# Altium schematic sheet 201944AEP4P03.SchDoc
size A4
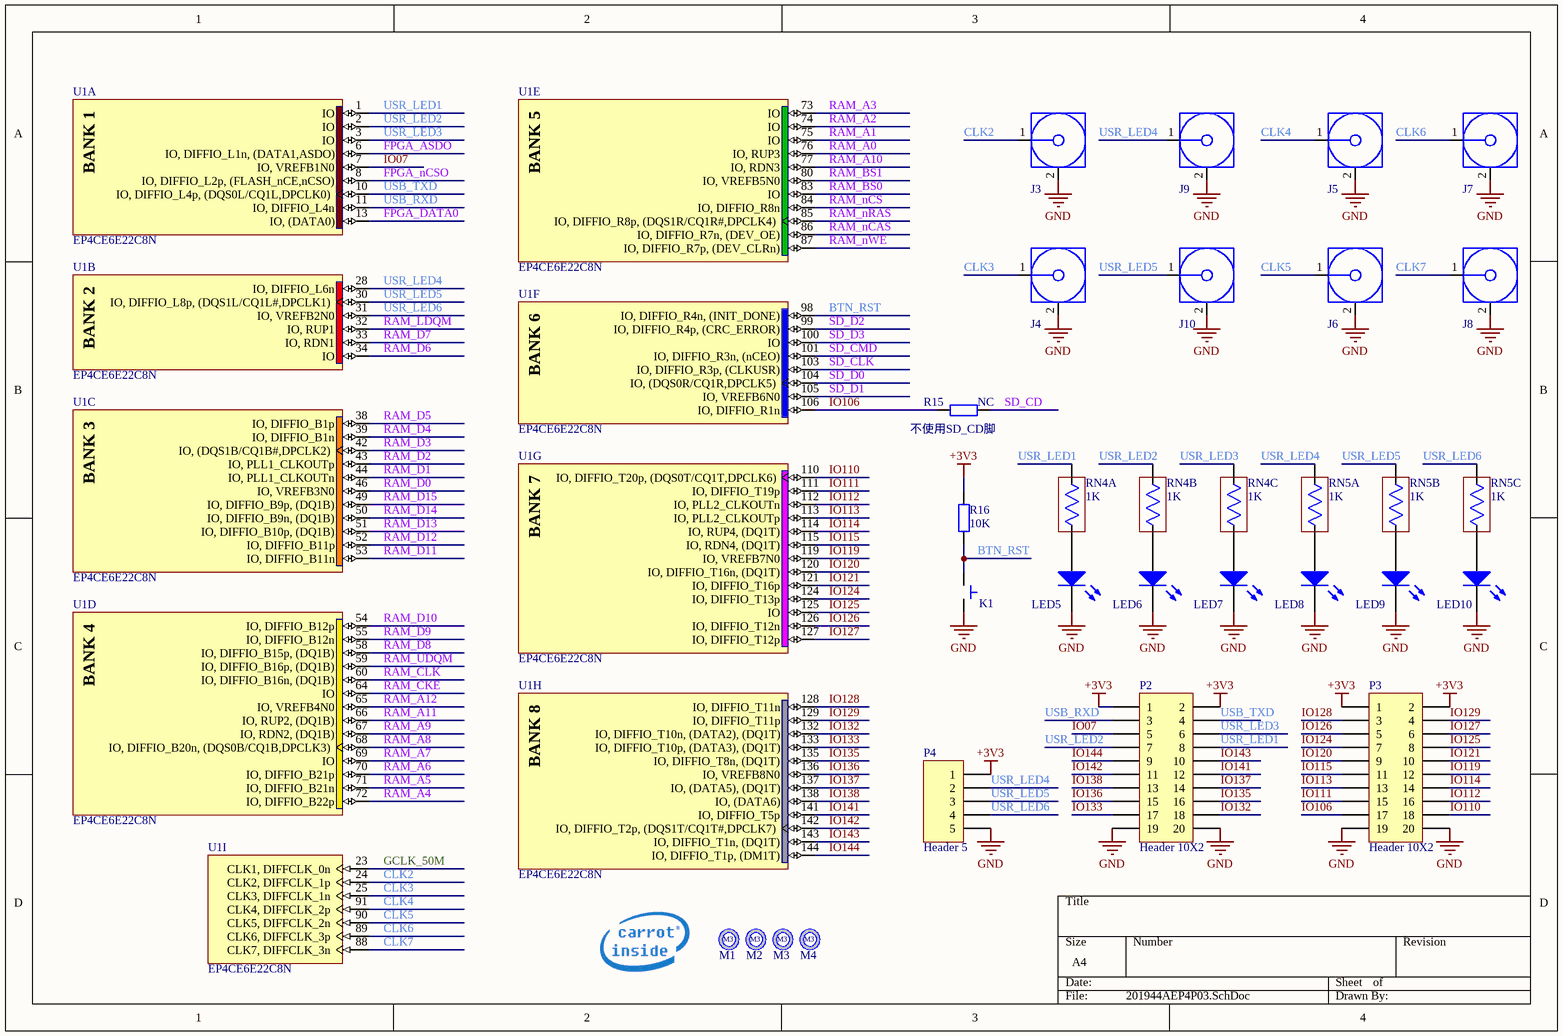
[diagram p0: 201944AEP4P03.SchDoc]

## Parts
J3  SMA  [SMA-1]  (value not drawn)
J4  SMA  [SMA-1]  (value not drawn)
J5  SMA  [SMA-1]  (value not drawn)
J6  SMA  [SMA-1]  (value not drawn)
J7  SMA  [SMA-1]  (value not drawn)
J8  SMA  [SMA-1]  (value not drawn)
J9  SMA  [SMA-1]  (value not drawn)
J10  SMA  [SMA-1]  (value not drawn)
K1  轻触开关  [Button-SMT-Small]  (value not drawn)
LED5  LED  [LED1206]  (value not drawn)
LED6  LED  [LED1206]  (value not drawn)
LED7  LED  [LED1206]  (value not drawn)
LED8  LED  [LED1206]  (value not drawn)
LED9  LED  [LED1206]  (value not drawn)
LED10  LED  [LED1206]  (value not drawn)
LOGO1  Logo Carrot Inside  [LOGO-carrot-inside]  (value not drawn)
M1  M3  [M3-3.2X5]  (value not drawn)
M2  M3  [M3-3.2X5]  (value not drawn)
M3  M3  [M3-3.2X5]  (value not drawn)
M4  M3  [M3-3.2X5]  (value not drawn)
P2  Header 10X2  [HDR2X10]
P3  Header 10X2  [HDR2X10]
P4  Header 5  [HDR1X5]
R15  value NC  [R0805]  (hidden comment: Res)
R16  value 10K  [R0805]  (hidden comment: Res)
RN4  value 1K  [RA0603]  (hidden comment: Res Array)  (parts A,B,C of 4)
RN5  value 1K  [RA0603]  (hidden comment: Res Array)  (parts A,B,C of 4)
U1  EP4CE6E22C8N  [EP4CE6E22C8N-EQFP144+]  (parts A,B,C,D,E,F,G,H,I of 13)

## Nets
+3V3: P2.1 P2.2 P3.1 P3.2 P4.1 R16.1
GND: J3.2(GND) J4.2(GND) J5.2(GND) J6.2(GND) J7.2(GND) J8.2(GND) J9.2(GND) J10.2(GND) K1.2(OUT) LED5.2(K) LED6.2(K) LED7.2(K) LED8.2(K) LED9.2(K) LED10.2(K) P2.19 P2.20 P3.19 P3.20 P4.5
BTN_RST: K1.1(IN) R16.2 U1.98(IO,_DIFFIO_R4n,_(INIT_DONE))
CLK2: J3.1(Signal) U1.24(CLK2,_DIFFCLK_1p)
CLK3: J4.1(Signal) U1.25(CLK3,_DIFFCLK_1n)
CLK4: J5.1(Signal) U1.91(CLK4,_DIFFCLK_2p)
CLK5: J6.1(Signal) U1.90(CLK5,_DIFFCLK_2n)
CLK6: J7.1(Signal) U1.89(CLK6,_DIFFCLK_3p)
CLK7: J8.1(Signal) U1.88(CLK7,_DIFFCLK_3n)
FPGA_ASDO: U1.6(IO,_DIFFIO_L1n,_(DATA1,ASDO))
FPGA_DATA0: U1.13(IO,_(DATA0))
FPGA_nCSO: U1.8(IO,_DIFFIO_L2p,_(FLASH_nCE,nCSO))
GCLK_50M: U1.23(CLK1,_DIFFCLK_0n)
IO07: P2.5 U1.7(IO,_VREFB1N0)
IO106: P3.17 R15.1 U1.106(IO,_DIFFIO_R1n)
IO110: P3.18 U1.110(IO,_DIFFIO_T20p,_(DQS0T/CQ1T,DPCLK6))
IO111: P3.15 U1.111(IO,_DIFFIO_T19p)
IO112: P3.16 U1.112(IO,_PLL2_CLKOUTn)
IO113: P3.13 U1.113(IO,_PLL2_CLKOUTp)
IO114: P3.14 U1.114(IO,_RUP4,_(DQ1T))
IO115: P3.11 U1.115(IO,_RDN4,_(DQ1T))
IO119: P3.12 U1.119(IO,_VREFB7N0)
IO120: P3.9 U1.120(IO,_DIFFIO_T16n,_(DQ1T))
IO121: P3.10 U1.121(IO,_DIFFIO_T16p)
IO124: P3.7 U1.124(IO,_DIFFIO_T13p)
IO125: P3.8 U1.125(IO)
IO126: P3.5 U1.126(IO,_DIFFIO_T12n)
IO127: P3.6 U1.127(IO,_DIFFIO_T12p)
IO128: P3.3 U1.128(IO,_DIFFIO_T11n)
IO129: P3.4 U1.129(IO,_DIFFIO_T11p)
IO132: P2.18 U1.132(IO,_DIFFIO_T10n,_(DATA2),_(DQ1T))
IO133: P2.17 U1.133(IO,_DIFFIO_T10p,_(DATA3),_(DQ1T))
IO135: P2.16 U1.135(IO,_DIFFIO_T8n,_(DQ1T))
IO136: P2.15 U1.136(IO,_VREFB8N0)
IO137: P2.14 U1.137(IO,_(DATA5),_(DQ1T))
IO138: P2.13 U1.138(IO,_(DATA6))
IO141: P2.12 U1.141(IO,_DIFFIO_T5p)
IO142: P2.11 U1.142(IO,_DIFFIO_T2p,_(DQS1T/CQ1T#,DPCLK7))
IO143: P2.10 U1.143(IO,_DIFFIO_T1n,_(DQ1T))
IO144: P2.9 U1.144(IO,_DIFFIO_T1p,_(DM1T))
RAM_A0: U1.76(IO,_RUP3)
RAM_A1: U1.75(IO)
RAM_A2: U1.74(IO)
RAM_A3: U1.73(IO)
RAM_A4: U1.72(IO,_DIFFIO_B22p)
RAM_A5: U1.71(IO,_DIFFIO_B21n)
RAM_A6: U1.70(IO,_DIFFIO_B21p)
RAM_A7: U1.69(IO)
RAM_A8: U1.68(IO,_DIFFIO_B20n,_(DQS0B/CQ1B,DPCLK3))
RAM_A9: U1.67(IO,_RDN2,_(DQ1B))
RAM_A10: U1.77(IO,_RDN3)
RAM_A11: U1.66(IO,_RUP2,_(DQ1B))
RAM_A12: U1.65(IO,_VREFB4N0)
RAM_BS0: U1.83(IO)
RAM_BS1: U1.80(IO,_VREFB5N0)
RAM_CKE: U1.64(IO)
RAM_CLK: U1.60(IO,_DIFFIO_B16n,_(DQ1B))
RAM_D0: U1.46(IO,_VREFB3N0)
RAM_D1: U1.44(IO,_PLL1_CLKOUTn)
RAM_D2: U1.43(IO,_PLL1_CLKOUTp)
RAM_D3: U1.42(IO,_(DQS1B/CQ1B#,DPCLK2))
RAM_D4: U1.39(IO,_DIFFIO_B1n)
RAM_D5: U1.38(IO,_DIFFIO_B1p)
RAM_D6: U1.34(IO)
RAM_D7: U1.33(IO,_RDN1)
RAM_D8: U1.58(IO,_DIFFIO_B15p,_(DQ1B))
RAM_D9: U1.55(IO,_DIFFIO_B12n)
RAM_D10: U1.54(IO,_DIFFIO_B12p)
RAM_D11: U1.53(IO,_DIFFIO_B11n)
RAM_D12: U1.52(IO,_DIFFIO_B11p)
RAM_D13: U1.51(IO,_DIFFIO_B10p,_(DQ1B))
RAM_D14: U1.50(IO,_DIFFIO_B9n,_(DQ1B))
RAM_D15: U1.49(IO,_DIFFIO_B9p,_(DQ1B))
RAM_LDQM: U1.32(IO,_RUP1)
RAM_nCAS: U1.86(IO,_DIFFIO_R7n,_(DEV_OE))
RAM_nCS: U1.84(IO,_DIFFIO_R8n)
RAM_nRAS: U1.85(IO,_DIFFIO_R8p,_(DQS1R/CQ1R#,DPCLK4))
RAM_nWE: U1.87(IO,_DIFFIO_R7p,_(DEV_CLRn))
RAM_UDQM: U1.59(IO,_DIFFIO_B16p,_(DQ1B))
SD_CD: R15.2
SD_CLK: U1.103(IO,_DIFFIO_R3p,_(CLKUSR))
SD_CMD: U1.101(IO,_DIFFIO_R3n,_(nCEO))
SD_D0: U1.104(IO,_(DQS0R/CQ1R,DPCLK5))
SD_D1: U1.105(IO,_VREFB6N0)
SD_D2: U1.99(IO,_DIFFIO_R4p,_(CRC_ERROR))
SD_D3: U1.100(IO)
USB_RXD: P2.3 U1.11(IO,_DIFFIO_L4n)
USB_TXD: P2.4 U1.10(IO,_DIFFIO_L4p,_(DQS0L/CQ1L,DPCLK0))
USR_LED1: P2.8 RN4.8 U1.1(IO)
USR_LED2: P2.7 RN4.7 U1.2(IO)
USR_LED3: P2.6 RN4.6 U1.3(IO)
USR_LED4: J9.1(Signal) P4.2 RN5.8 U1.28(IO,_DIFFIO_L6n)
USR_LED5: J10.1(Signal) P4.3 RN5.7 U1.30(IO,_DIFFIO_L8p,_(DQS1L/CQ1L#,DPCLK1))
USR_LED6: P4.4 RN5.6 U1.31(IO,_VREFB2N0)
NetLED5_1: LED5.1(A) RN4.1
NetLED6_1: LED6.1(A) RN4.2
NetLED7_1: LED7.1(A) RN4.3
NetLED8_1: LED8.1(A) RN5.1
NetLED9_1: LED9.1(A) RN5.2
NetLED10_1: LED10.1(A) RN5.3

## Notes on the sheet
- (near R15) 不使用SD_CD脚
- (in symbol EP4CE6E22C8N, part A) BANK 1
- (in symbol EP4CE6E22C8N, part B) BANK 2
- (in symbol EP4CE6E22C8N, part C) BANK 3
- (in symbol EP4CE6E22C8N, part D) BANK 4
- (in symbol EP4CE6E22C8N, part E) BANK 5
- (in symbol EP4CE6E22C8N, part F) BANK 6
- (in symbol EP4CE6E22C8N, part G) BANK 7
- (in symbol EP4CE6E22C8N, part H) BANK 8

## Library data of the parts
K1 = Button
P2 P3 = Header 10X2: Header, 10-Pin, Dual row; LatestRevisionDate: 17-Jul-2002; LatestRevisionNote: Re-released for DXP Platform.; Publisher: Altium Limited
P4 = Header 5: Header, 5-Pin; LatestRevisionDate: 17-Jul-2002; LatestRevisionNote: Re-released for DXP Platform.; Publisher: Altium Limited
RN4 RN5 = Res Array 2: 贴片排阻
U1 = EP4CE6E22C8N: Cyclone IV Family FPGA, 1.2V Core, 91 I/O Pins, 2 PLLs, 144-Pin QFP, Speed Grade 8, Commercial Grade, Pb-Free; Manufacturer: Altera; DatasheetVersion: ver1.6, Nov-2011; PackageVersion: ver1.0, Jan-2011; PackageReference: EQFP144_A-165_D2-54; PackageDescription: 144-Pin Plastic Enhanced Quad Flat Pack (EQFP) - Wire Bond - A:1.65 - D2:5.4; Code_JEDEC: MS-026-BFB-HD; ComponentLink1Description: Manufacturer URL; ComponentLink1URL: http://www.altera.com/; ComponentLink2Description: Handbook; ComponentLink2URL: http://www.altera.com/literature/hb/cyclone-iv/cyclone4-handbook.pdf; ComponentLink3Description: Pinout; ComponentLink3URL: http://www.altera.com/literature/lit-dp.jsp?category=cyc%204&showspreadsheet=y; ComponentLink4Description: Package Specification; ComponentLink4URL: http://www.altera.com/devicepackaging/04R00402-00.pdf